# EAGLE design puckjs (EAGLE 7.7.0)
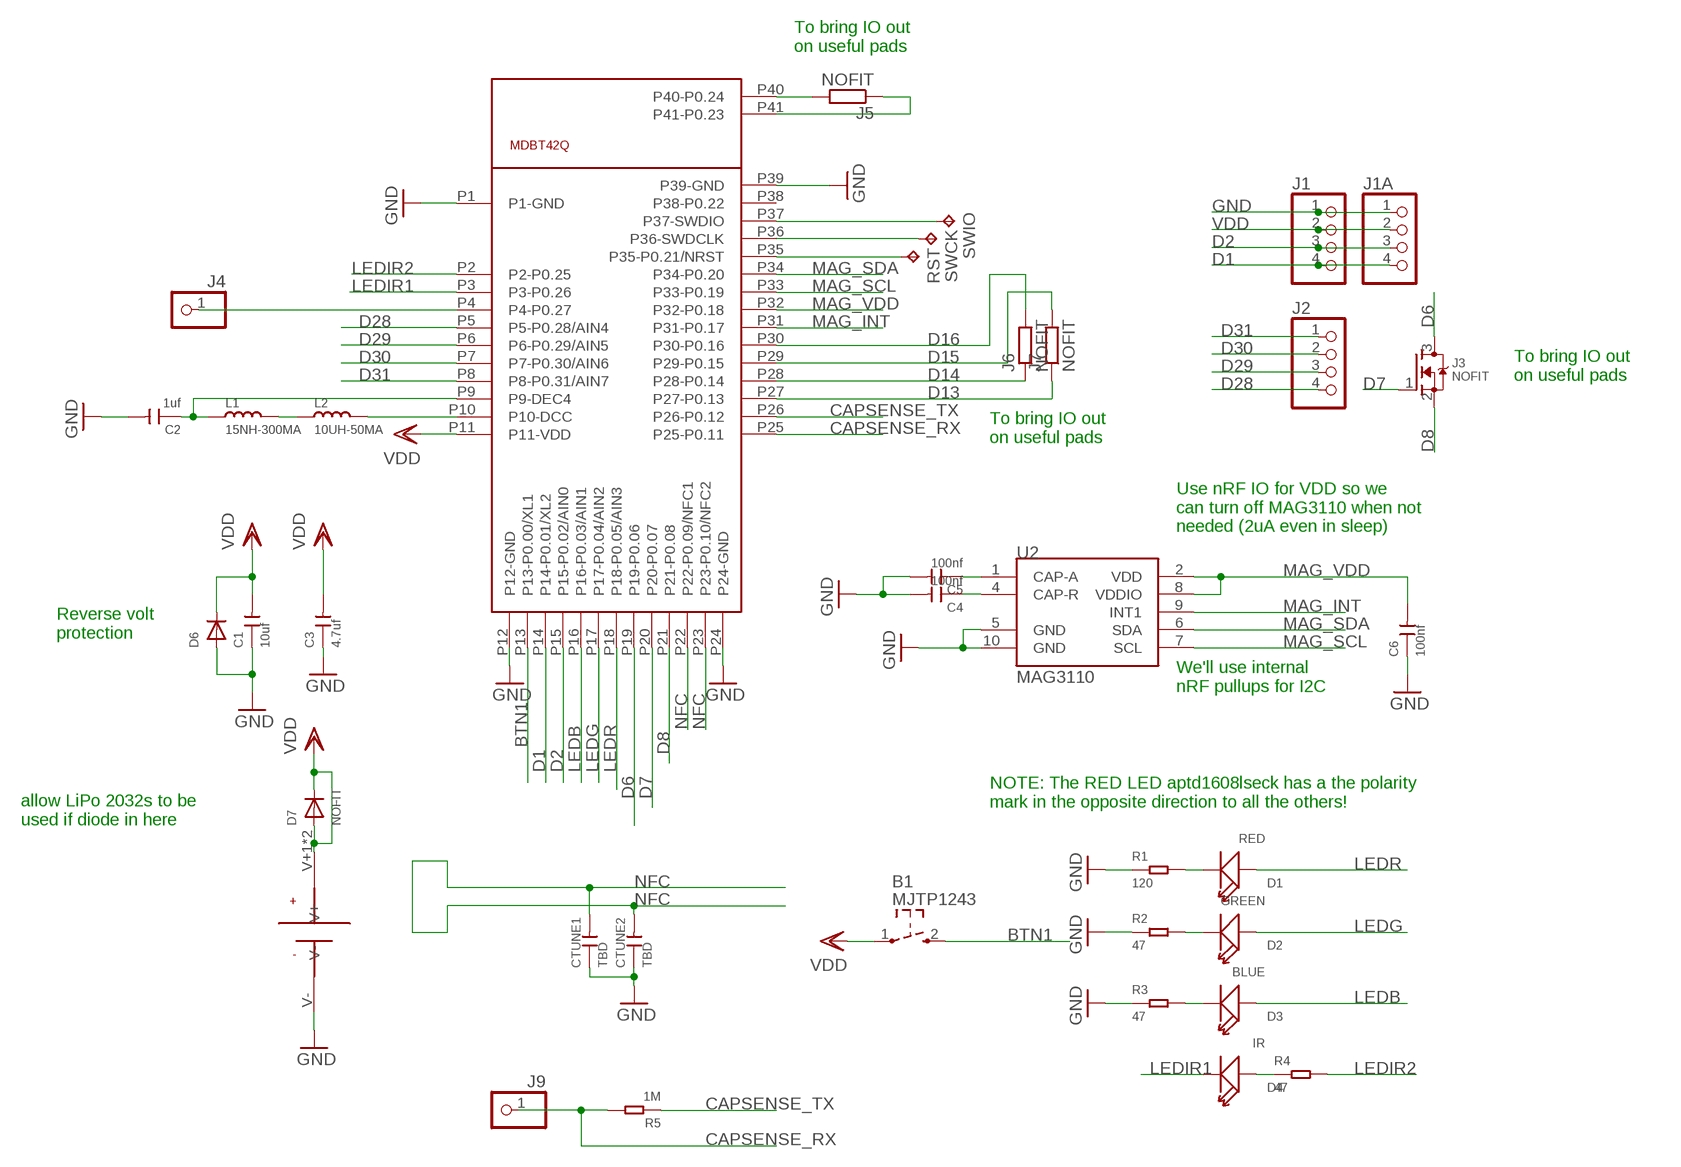
[diagram p0: schematic, sheet 1]

## Parts
B1  MJTP1243  [MJTP1243]
C1  10uf  CERAMIC-47UF-6.3V-20%-X5R(0805)  [C0805]
C2  1uf  CERAMIC-4.7UF-6.3V-20%-X5R(0402)  [C0402]
C3  4.7uf  CERAMIC-4.7UF-6.3V-20%-X5R(0402)  [C0402]
C4  100nf  CERAMIC-100NF-25V-10%-X7R(0402)  [C0402]
C5  100nf  CERAMIC-100NF-25V-10%-X7R(0402)  [C0402]
C6  100nf  CERAMIC-100NF-25V-10%-X7R(0402)  [C0402]
CTUNE1  TBD  CERAMIC-0.5PF-50V-0.1PF-NPO(0402)  [C0402]
CTUNE2  TBD  CERAMIC-0.5PF-50V-0.1PF-NPO(0402)  [C0402]
D1  RED  SMD-LED-CLEAR-BLUE(0603)  [LED-0603]
D2  GREEN  SMD-LED-CLEAR-BLUE(0603)  [LED-0603]
D3  BLUE  SMD-LED-CLEAR-BLUE(0603)  [LED-0603]
D4  IR  SMD-LED-CLEAR-BLUE(0603)  [LED-0603]
D6  DIODESOD-523  [SOD-523]
D7  NOFIT  DIODESOD-523  [SOD-523]
J1  PINHD-1X04_2.54-S  [1X04-S]
J1A  PINHD-1X04  [1X04M2]
J2  PINHD-1X04_2.54-S  [1X04-S]
J3  NOFIT  MOSFET-NREFLOW  [SOT23]
J4  PINHD-1X1  [1X01]
J5  NOFIT  R-EU_R1206  [R1206]
J6  NOFIT  R-EU_R0603  [R0603]
J7  NOFIT  R-EU_R0603  [R0603]
J8  KEYSTONE-3003  [KEYSTONE-3003]
J9  PINHD-1X1  [1X01]
L1  15NH-300MA  SMD-INDUCTOR-15NH-5%-300MA(0402)  [L0402]
L2  10UH-50MA  SMD-INDUCTOR-10UH-20%-50MA(0603)  [L0603]
R1  120  SMD-RES-300R-5%-1/16W(0402)  [R0402]
R2  47  SMD-RES-300R-5%-1/16W(0402)  [R0402]
R3  47  SMD-RES-300R-5%-1/16W(0402)  [R0402]
R4  47  SMD-RES-300R-5%-1/16W(0402)  [R0402]
R5  1M  SMD-RES-300R-5%-1/16W(0402)  [R0402]
RST  TPTP15R  [TP15R]
SWCK  TPTP15R  [TP15R]
SWIO  TPTP15R  [TP15R]
U1  MDBT42Q  [MDBT40]
U2  MAG3110  [DFN-10]

## Nets
BTN1: B1.2 U1.P13(P13-P0.00/XL1)
CAPSENSE_RX: J9.1 R5.2 U1.P25(P25-P0.11)
CAPSENSE_TX: R5.1 U1.P26(P26-P0.12)
D1: J1.4 J1A.4 U1.P14(P14-P0.01/XL2)
D2: J1.3 J1A.3 U1.P15(P15-P0.02/AIN0)
D6: J3.3(D) U1.P19(P19-P0.06)
D7: J3.1(G) U1.P20(P20-P0.07)
D8: J3.2(S) U1.P21(P21-P0.08)
D13: J7.1 U1.P27(P27-P0.13)
D14: J6.1 U1.P28(P28-P0.14)
D15: J7.2 U1.P29(P29-P0.15)
D16: J6.2 U1.P30(P30-P0.16)
D28: J2.4 U1.P5(P5-P0.28/AIN4)
D29: J2.3 U1.P6(P6-P0.29/AIN5)
D30: J2.2 U1.P7(P7-P0.30/AIN6)
D31: J2.1 U1.P8(P8-P0.31/AIN7)
GND: C1.1 C2.2 C3.1 C4.2 C5.2 C6.1 CTUNE1.1 CTUNE2.1 D6.A J1.1 J1A.1 J8.V- R1.1 R2.1 R3.1 U1.P1(P1-GND) U1.P12(P12-GND) U1.P24(P24-GND) U1.P39(P39-GND) U2.5(GND) U2.10(GND)
LEDB: D3.+ U1.P16(P16-P0.03/AIN1)
LEDG: D2.+ U1.P17(P17-P0.04/AIN2)
LEDIR1: D4.- U1.P3(P3-P0.26)
LEDIR2: R4.2 U1.P2(P2-P0.25)
LEDR: D1.+ U1.P18(P18-P0.05/AIN3)
MAG_INT: U1.P31(P31-P0.17) U2.9(INT1)
MAG_SCL: U1.P33(P33-P0.19) U2.7(SCL)
MAG_SDA: U1.P34(P34-P0.20) U2.6(SDA)
MAG_VDD: C6.2 U1.P32(P32-P0.18) U2.2(VDD) U2.8(VDDIO)
N$1: D1.- R1.2
N$2: D2.- R2.2
N$3: D3.- R3.2
N$4: J4.1 U1.P4(P4-P0.27)
N$5: SWCK.TP U1.P36(P36-SWDCLK)
N$6: SWIO.TP U1.P37(P37-SWDIO)
N$7: J5.2 U1.P40(P40-P0.24)
N$8: J5.1 U1.P41(P41-P0.23)
N$9: D4.+ R4.1
N$10: C2.1 L1.1 U1.P9(P9-DEC4)
N$11: L1.2 L2.1
N$12: C5.1 U2.1(CAP-A)
N$13: L2.2 U1.P10(P10-DCC)
N$14: RST.TP U1.P35(P35-P0.21/NRST)
N$16: C4.1 U2.4(CAP-R)
NFC: CTUNE1.2 CTUNE2.2 U1.P22(P22-P0.09/NFC1) U1.P23(P23-P0.10/NFC2)
VDD: B1.1 C1.2 C3.2 D6.K(C) D7.A D7.K(C) J1.2 J1A.2 J8.V+1(V+) J8.V+2(V+) U1.P11(P11-VDD)
Unconnected: U1.P38(P38-P0.22)

## Notes on the sheet
- To bring IO out
  on useful pads
- To bring IO out
  on useful pads
- To bring IO out
  on useful pads
- Use nRF IO for VDD so we
  can turn off MAG3110 when not
  needed (2uA even in sleep)
- Reverse volt
  protection
- We'll use internal
  nRF pullups for I2C
- NOTE: The RED LED aptd1608lseck has a the polarity 
  mark in the opposite direction to all the others!
- allow LiPo 2032s to be
  used if diode in here

## Library data of the parts
B1 = Lowduino:MJTP1243
C1 = Seeed-OPL-Capacitor:CERAMIC-47UF-6.3V-20%-X5R(0805): 302010166; MPN: CC0805MKX5R5BB476; VALUE: 47uf
C2 = Seeed-OPL-Capacitor:CERAMIC-4.7UF-6.3V-20%-X5R(0402): 302010019; MPN: CC0402MRX5R5BB475; VALUE: 4.7uf
C3 = Seeed-OPL-Capacitor:CERAMIC-4.7UF-6.3V-20%-X5R(0402): 302010019; MPN: CC0402MRX5R5BB475
C4-C6 = Seeed-OPL-Capacitor:CERAMIC-100NF-25V-10%-X7R(0402): 302010024; MPN: CC0402KRX7R8BB104
CTUNE1 CTUNE2 = Seeed-OPL-Capacitor:CERAMIC-0.5PF-50V-0.1PF-NPO(0402): 302010048; MPN: CC0402BRNPO9BNR50; VALUE: 0.5pf
D1-D4 = Seeed-OPL-Diode:SMD-LED-CLEAR-BLUE(0603): 304090045; MPN: 19-217-BHC-ZL1M2RY-3T; VALUE: BLUE-0603
D6 D7 = adafruit:DIODE: Diode SMADIODE - SMA Surface Mount Package 20V 1A Schottky Diode Digikey: 641-1014-6-ND DO-1N4148 - Through Hole Small Current Diode SOD-123 20V 1 A (.5mV Vf) Schottky Diode - Digikey: MBRX120TPMSCT-ND SOD-323 10V 570mA (.38mV Vf, 3ns) Schottky Diode - Digikey: ZLLS410CT-ND SOD-523 30V 30mA Schottky Diode (RB751S-40TE61) - Digikey: RB751S-40TE61CT-ND SOT23-R/W - SOT23 Package (R = Solder Paste/Reflow Ovens, W = Hand-Soldering) BAT54Film 40V 300mA - Digikey: 497-7162-1-ND
J1 J1A J2 = pinhead-2:PINHD-1X04: PIN HEADER
J3 = adafruit:MOSFET-N: N-Channel Mosfet 2N7002E - 60V 260mA SOT23 [Digikey: 2N7002ET1GOSTR-ND] - REEL BSH103 - 30V 850mA SOT23 [Digikey: 568-5013-1-ND]
J4 J9 = pinhead:PINHD-1X1: PIN HEADER
J5-J7 = rcl:R-EU_: RESISTOR, European symbol
J8 = cr2032:KEYSTONE-3003
L1 = Seeed-OPL-Inductor:SMD-INDUCTOR-15NH-5%-300MA(0402): 303010027; MPN: LQG15HS15NJ02
L2 = Seeed-OPL-Inductor:SMD-INDUCTOR-10UH-20%-50MA(0603): 303010026; MPN: LQM18FN100M00
R1-R5 = Seeed-OPL-Resistor:SMD-RES-300R-5%-1/16W(0402): 301010073; MPN: RC0402JR-07300RL; VALUE: 300R 1/16W
RST SWCK SWIO = testpad:TP: Test pad
U1 = mdbt42:MDBT42Q
U2 = SparkFun-Sensors:MAG3110: 3-axis digital (I2C) magnetometer

## Board
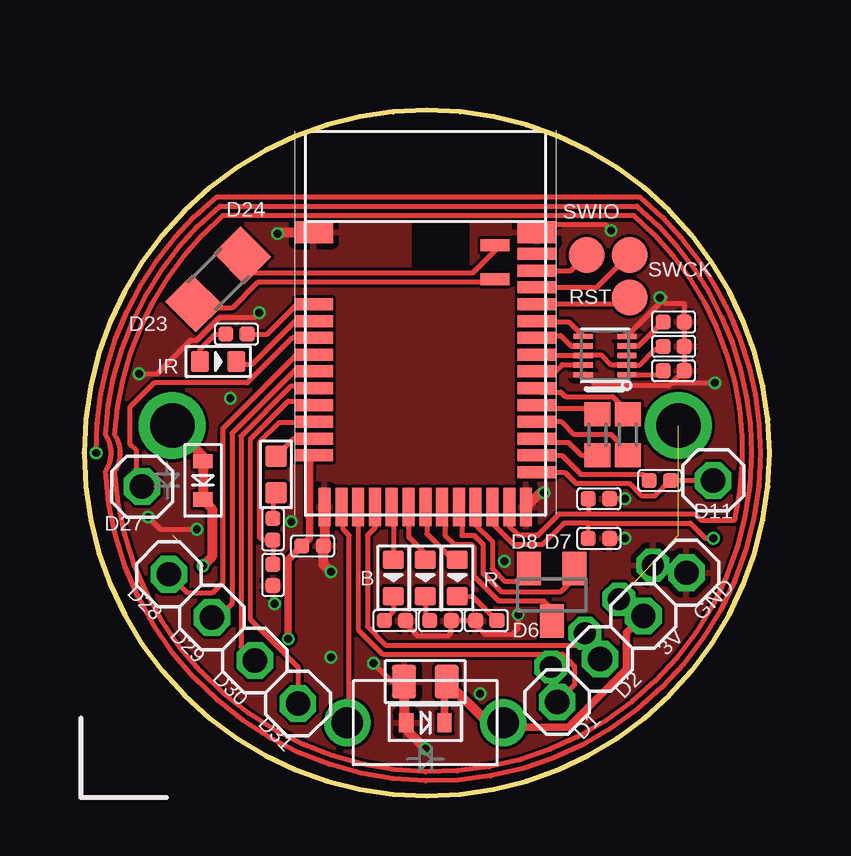
[diagram p1: board, top side]
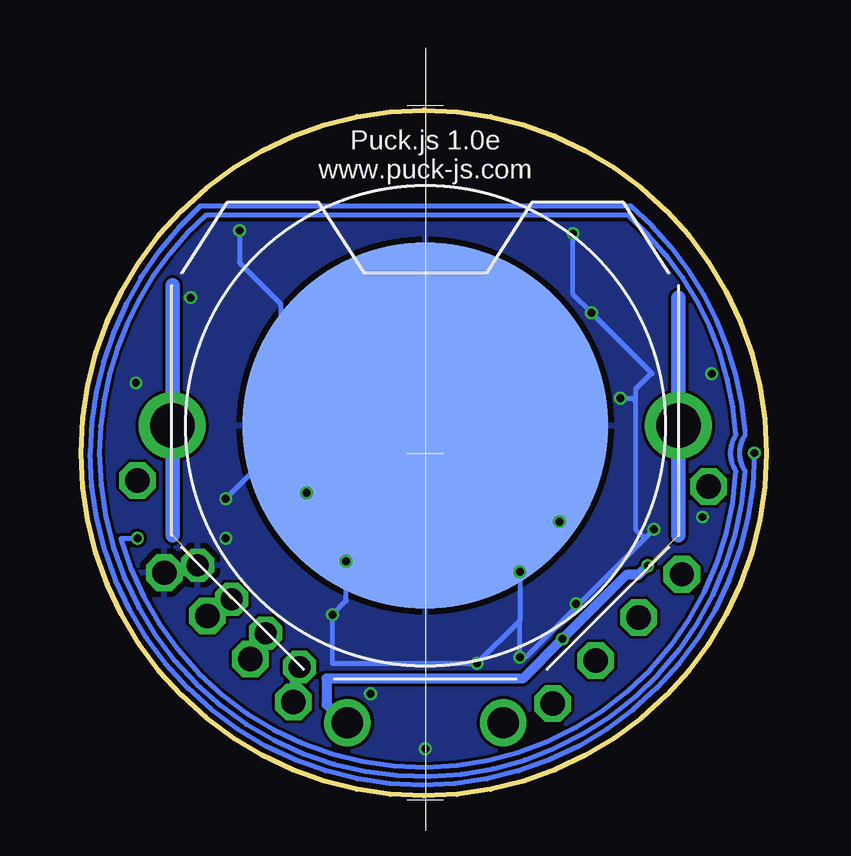
[diagram p2: board, bottom side, seen from below]

Size 28.58 x 28.57 mm. Coordinates in mm from the lower left corner, seen from the top.
Outline: 28.58,14.29 arc180 0,14.29 arc180 28.58,14.29
Copper layers (1*16): Top 0.035559375mm / dielectric 0.17018125mm / Bottom 0.035559375mm
Design rules "espruino": minimum track width 5mil, minimum drill 10mil, track to track 5mil, track to pad 5mil, pad to pad 5mil, via to via 5mil, smd to smd 0mil, copper to edge 4mil, drill to drill 6mil, minimum pad ring 4mil, minimum via ring 4mil, stop-mask expansion 4mil, vias tented up to drill 15mil, thermal gap 10mil

### Footprints (pad centres in the part's own frame; a part is rotated, then mirrored left to right if it is on the bottom)
MJTP1243 = drill 1.3: 1 -3.25,0; 2 3.25,0
C0805 = smd 1.397 x 1.016: 1 0,0.889; 2 0,-0.889
C0402 = smd 0.635 x 0.635: 1 0,0.445; 2 0,-0.445
LED-0603 = smd 0.762 x 0.889: + -0.762,0; - 0.762,0
SOD-523 = smd 0.8 x 0.6: A 0,-0.8; K 0,0.8
1X04-S = drill 1.016 octagon: 1 -3.81,0; 2 -1.27,0; 3 1.27,0; 4 3.81,0
1X04M2 = drill 0.914 octagon: 1 -3,0; 2 -1,0; 3 1,0; 4 3,0
SOT23 = smd 1 x 1.4: 1 -0.95,-1.1; 2 0.95,-1.1; 3 0,1.1
1X01 = drill 1.016 octagon: 1 0,0
R1206 = smd 1.6 x 1.803: 1 -1.422,0; 2 1.422,0
R0603 = smd 1 x 1.1: 1 -0.85,0; 2 0.85,0
KEYSTONE-3003 = drill 1.854: V+1 -10.554,0; V+2 10.554,0 | smd 15.24 x 15.24: V- 0,0
L0402 = smd 0.635 x 0.635: 1 -0.445,0; 2 0.445,0
L0603 = smd 0.889 x 0.889: 1 -0.762,0; 2 0.762,0
R0402 = smd 0.635 x 0.635: 1 0,0.445; 2 0,-0.445
TP15R = smd 1.5 x 1.5: TP 0,0
MDBT40 = smd 1.6 x 0.9: P1 -4.65,3.8; P39 4.65,3.8 | smd 1.6 x 0.5: P2 -4.65,0.8; P3 -4.65,0.1; P4 -4.65,-0.6; P5 -4.65,-1.3; P6 -4.65,-2; P7 -4.65,-2.7; P8 -4.65,-3.4; P9 -4.65,-4.1; P10 -4.65,-4.8; P11 -4.65,-5.5; P25 4.65,-6.2; P26 4.65,-5.5; P27 4.65,-4.8; P28 4.65,-4.1; P29 4.65,-3.4; P30 4.65,-2.7; P31 4.65,-2; P32 4.65,-1.3; P33 4.65,-0.6; P34 4.65,0.1; P35 4.65,0.8; P36 4.65,1.5; P37 4.65,2.2; P38 4.65,2.9 | smd 0.5 x 1.6: P12 -4.2,-7.65; P13 -3.5,-7.65; P14 -2.8,-7.65; P15 -2.1,-7.65; P16 -1.4,-7.65; P17 -0.7,-7.65; P18 0,-7.65; P19 0.7,-7.65; P20 1.4,-7.65; P21 2.1,-7.65; P22 2.8,-7.65; P23 3.5,-7.65; P24 4.2,-7.65 | smd 1.2 x 0.5: P40 2.9,3.25; P41 2.9,1.85
DFN-10 = smd 0.8 x 0.22: 1 -0.91,0.8; 2 -0.91,0.4; 3 -0.91,0; 4 -0.91,-0.4; 5 -0.91,-0.8; 6 0.91,-0.8; 7 0.91,-0.4; 8 0.91,0; 9 0.91,0.4; 10 0.91,0.8

### Placement (x,y rotation side)
B1  14.22,3.05 180 top
C1  14.22,4.76 90 top
C2  7.87,9.21 0 top
C3  9.52,10.41 270 top
C4  24.57,19.75 90 top
C5  24.57,17.72 90 top
C6  24.57,18.73 270 top
CTUNE1  21.46,12.38 270 top
CTUNE2  21.46,10.73 270 top
D1  15.56,9.08 270 top
D2  14.22,9.08 270 top
D3  12.89,9.08 270 top
D4  5.59,18.1 0 top
D6  14.22,3.05 270 top
D7  4.95,13.14 180 top
J1  22.42,6.6 225 top
J1A  21.59,7.49 225 top
J2  6.22,6.54 135 top
J3  19.49,8.38 180 top
J4  2.41,12.89 0 top
J5  5.59,21.53 45 top
J6  22.67,15.05 90 top
J7  21.4,15.05 90 top
J8  14.22,15.43 180 bottom
J9  26.23,13.14 0 top
L1  7.87,11.11 90 top
L2  8,13.4 90 top
R1  16.76,7.3 90 top
R2  14.86,7.3 270 top
R3  12.95,7.3 270 top
R4  6.35,19.24 90 top
R5  24,13.14 90 top
RST  22.73,20.76 0 top
SWCK  22.73,22.54 0 top
SWIO  20.96,22.54 0 top
U1  14.22,19.68 0 top
U2  21.72,18.35 180 top

### Tracks (layer width: path | path; a pad name or v marks a point on that pad's centre or on a via)
BTN1
  Top 0.203: 10.99,3.06 B1.2 11.05,3.12 11.05,10.86 10.79,11.11 10.79,11.96 U1.P13
CAPSENSE_RX
  Top 0.203: U1.P25 20.04,13.49 20.51,13.02 22.73,13.02 23.24,12.51 23.81,12.51 R5.2 J9.1
CAPSENSE_TX
  Top 0.203: U1.P26 19.91,14.18 20.7,13.4 23.3,13.4 R5.1
D1
  Top 0.203: U1.P14 11.42,6.93 12.45,5.91 19.94,5.91 20.45,5.4 20.45,4.64 J1.4
  Bottom 0.305: J1A.4 19.72,5.12 J1.4
D2
  Top 0.203: U1.P15 12.12,11.17 11.81,10.86 11.81,7.05 12.57,6.29 20.94,6.29 J1.3
  Bottom 0.305: J1A.3 21.52,6.15 J1.3
D6
  Top 0.203: U1.P19 15.05,11.91 15.05,10.86 15.43,10.48 16.13,10.48 16.26,10.35 16.26,9.14 17.27,8.13 19.18,8.13 19.5,7.81 J3.3
D7
  Top 0.203: U1.P20 15.75,11.91 15.75,10.86 16.26,10.86 16.64,10.48 16.64,9.27 17.4,8.51 19.88,8.51 20.45,9.08 J3.1
D8
  Top 0.203: U1.P21 16.32,11.3 17.02,10.6 17.02,9.46 17.53,8.95 18.02,8.95 J3.2
D13
  Top 0.203: U1.P27 19.03,14.73 20.19,14.73 20.73,14.2 J7.1
D14
  Top 0.203: J6.1 22.29,14.58 22.29,14.73 21.97,15.05 20.45,15.05 19.91,15.59 U1.P28
D15
  Top 0.203: J7.2 21.17,16.13 19.43,16.13 19.28,16.29 U1.P29
D16
  Top 0.203: U1.P30 19.03,16.83 19.88,16.83 20.07,16.64 22.04,16.64 22.67,16 J6.2
D28
  Top 0.203: J2.4 4.32,8.45 5.33,8.45 5.78,8.89 5.78,15.3 8.86,18.38 U1.P5
D29
  Top 0.203: U1.P6 9.48,17.78 8.83,17.78 6.16,15.11 6.16,8 5.6,7.44 J2.3
D30
  Top 0.203: U1.P7 9.48,17.08 8.64,17.08 6.54,14.99 6.54,6.2 7.1,5.64 J2.2
D31
  Top 0.203: 8.89,3.87 J2.1 8.92,5.37 6.92,7.37 6.92,14.86 8.51,16.45 9.41,16.45 U1.P8
GND  (via drill 0.33)
  Top 0.203: 22.6,19.18 U2.5 24.12,20.65 | U1.P39 19.36,23.49 19.69,23.81 21.72,23.81 v21.97,23.56 | 13.4,7.49 R3.1 13.4,7.18 13.91,6.67 15.18,6.67 15.3,6.79 R2.1 R1.1 | R1.1 16.32,7.37 | R1.1 16.32,7.11 16.7,6.73 17.84,6.73 18.1,6.98 v18.1,7.56 | C1.1 12.83,4.76 v12.06,5.52 | 10.02,10.47 C3.1 | CTUNE2.1 v22.54,10.73 | 24.51,17.21 C5.2 C6.1 C4.2 25.02,20.51 24.26,20.51 24.12,20.65 | U2.10 20.87,17.55 21.34,17.08 24.38,17.08 24.51,17.21 | 24.51,17.21 v26.29,17.21 | 24.12,20.65 24.24,20.76 | v2.67,11.62 3.17,11.11 v4.7,11.11 | 13.33,2.86 13.33,2.96 D6.A | v24,20.76 24.12,20.65 | v22.54,12.38 CTUNE1.1 | v2.29,17.59 3.05,17.59 4.45,18.99 4.7,18.99 5.65,19.94 7.11,19.94 v7.3,20.13
  Top 0.406: U1.P24 19.03,12.64 v19.18,12.64 | C1.1 13.33,2.86 v14.22,1.97 | U1.P12 10.02,10.47 | C3.1 9.97,9.65 v10.29,9.33 | v8.06,23.43 8.12,23.49 U1.P1
  Bottom 0.203: 15.37,15.68 18.54,15.68 21.15,13.08 | 15.37,15.68 17.91,18.22 20.13,18.22 20.26,18.1 20.26,20.51 21.97,22.22 v21.97,23.56 | 21.15,13.08 21.27,12.95 20.89,12.57 | v19.18,12.64 19.5,12.95 19.69,12.76 | 10.29,7.3 v10.29,9.33 10.29,10.1 | 10.29,7.3 v12.06,5.52 18.1,5.52 v18.1,7.56 17.53,8.13 v17.53,9.78 17.78,9.78 19.18,11.18 v19.18,12.64 | 20.13,13.59 v19.18,12.64 | 20.13,13.59 20.64,13.08 21.15,13.08 | 10.29,7.3 v10.29,5.78 10.03,5.78 5.08,10.73 | v4.7,11.11 5.08,10.73 | 4.76,17.59 v7.3,20.13 8.06,20.89 v8.06,23.43 | 4.83,17.59 5.46,16.95 5.46,16.45 | 5.46,16.45 5.46,11.11 5.08,10.73 | 15.37,15.68 14.48,15.68 J8.V- | 23.75,9.65 J1A.1 | v6.1,16.57 5.59,16.57 5.46,16.45 | v22.54,12.38 21.34,13.59 20.13,13.59
  Bottom 0.305: J1A.1 24.03,9.3 J1.1 | v8.64,11.43 8.95,11.43 C3.1 9.97,9.65 v10.29,9.33
  other vias: 7.94,8 16.51,4.25
  pour Top: -0.13,23.81 29.08,23.81 29.08,-0.06 -0.13,-0.06
  pour Bottom: -0.13,23.81 29.08,23.81 29.08,-0.06 -0.13,-0.06
LEDB
  Top 0.203: U1.P16 12.89,11.97 D3.+
LEDG
  Top 0.203: U1.P17 13.52,10.8 14.22,10.1 D2.+
LEDIR1
  Top 0.203: U1.P3 8.8,19.79 6.99,17.97 6.48,17.97 D4.-
LEDIR2
  Top 0.203: R4.2 7.62,19.24 8.89,20.51 9.55,20.51 U1.P2
LEDR
  Top 0.203: U1.P18 14.29,11.97 14.29,10.92 15.37,9.84 D1.+
MAG_INT
  Top 0.203: 20.83,17.97 U2.9 20.79,17.97 19.94,17.97 19.65,17.68 U1.P31
MAG_SCL
  Top 0.203: U1.P33 18.97,19.18 19.88,19.18 20.32,18.73 20.79,18.73 U2.7
MAG_SDA
  Top 0.203: U1.P34 18.91,19.75 20.21,19.75 U2.6
MAG_VDD
  Top 0.203: U1.P32 18.9,18.42 19.56,18.42 19.62,18.35 U2.8 21.59,18.35 21.99,17.95 U2.2 23.16,17.95 23.81,18.61 24,18.61 C6.2
N$1
  Top 0.203: D1.- 16.19,8.32 R1.2
N$2
  Top 0.203: D2.- 14.22,7.49 R2.2
N$3
  Top 0.203: D3.- 12.89,7.68 R3.2
N$4
  Top 0.203: U1.P4 8.67,19.08 6.79,17.21 2.92,17.21 1.91,16.19 1.91,14.67 2.16,14.41 2.16,13.14 J4.1
N$5
  Top 0.203: U1.P36 21.38,21.18 SWCK.TP
N$6
  Top 0.203: U1.P37 20.3,21.88 SWIO.TP
N$7
  Top 0.203: U1.P40 17.35,22.93 16.19,21.78 6.96,21.78 6.96,22.16 J5.2
N$8
  Top 0.203: J5.1 4.78,20.32 6.16,20.32 7.24,21.4 16.99,21.4 U1.P41
N$9
  Top 0.203: D4.+ 4.83,18.61 5.46,19.24 R4.1
N$10
  Top 0.203: U1.P9 9.55,15.56 8.13,15.56 7.3,14.73 7.3,10.79 7.43,10.67 L1.1 C2.1
N$11
  Top 0.203: L2.1 7.87,12.51 L1.2
N$12
  Top 0.203: U2.1 23.96,17.55 C5.1
N$13
  Top 0.203: L2.2 8.72,14.88 U1.P10
N$14
  Top 0.203: RST.TP 22.45,20.49 U1.P35
N$16
  Top 0.203: 22.61,18.73 U2.4 23.13,18.75 C4.1
NFC  (via drill 0.33)  (1 unrouted)
  Top 0.203: 21.02,11.75 19.81,11.75 18.92,10.86 18.1,10.86 17.72,11.24 U1.P23 | 21.02,11.37 20,11.37 19.11,10.48 17.91,10.48 17.02,11.36 U1.P22 | CTUNE2.2 21.02,11.37 | 21.02,11.37 25.27,11.37 25.91,10.73 v26.23,10.73 | CTUNE1.2 21.02,11.75 | 21.02,11.75 25.46,11.75 25.72,11.49 27.11,11.49 arc62 22.92,24.19 5.78,24.19 arc45 1.27,15.05 arc-70 1.27,13.53 arc177 27.81,14.29 arc50 23.05,24.57 5.65,24.57 arc47 0.89,15.05 arc-70 0.89,13.53 arc177 28.19,14.29 arc50 23.18,24.96 5.53,24.96 arc52 v0.51,14.29
  Bottom 0.203: v0.51,14.29 arc180 28.19,14.29 arc47 23.62,24.57 5.65,24.57 arc45 0.89,15.18 | 0.89,15.05 arc-70 0.89,13.53 arc177 27.81,14.29 arc48 23.37,24.19 5.78,24.19 arc45 1.27,15.05 arc-70 1.27,13.53 arc161 26.92,10.73 v26.23,10.73
VDD  (via drill 0.33)  (3 unrouted)
  Top 0.203: 15.02,4.67 C1.2
  Top 0.305: J1.2 22.61,6.79 22.61,5.27 20.19,2.86 18.42,2.86 18.23,3.05 | U1.P11 9.57,14.21 9.4,14.03 9.4,10.73 C3.2 8.51,9.84 v8.51,6.54 | D6.K 15.02,4.67
  Top 0.406: C1.2 16.83,3.05 B1.1 18.23,3.05 | J8.V+1 4.95,14.15 D7.A D7.K 5.33,11.96 5.33,9.97 v4.95,9.59
  Bottom 0.305: J1A.2 23,7.5 J1.2
  Bottom 0.406: v4.95,9.59 5.33,9.21 5.84,9.21 v8.51,6.54 10.16,4.89 18.35,4.89 18.35,3.81 17.59,3.05 B1.1
  Bottom 0.61: 3.68,20.76 3.68,10.86 | 24.77,21.27 24.77,10.86

### Text on the board
tNames: D24 | D23 | IR | D11 | D27 | D8 D7 | B | R | D28 | GND | D6 | D29 | 3V | D30 | D2 | D31 | D1
bNames: Puck.js 1.0e / www.puck-js.com